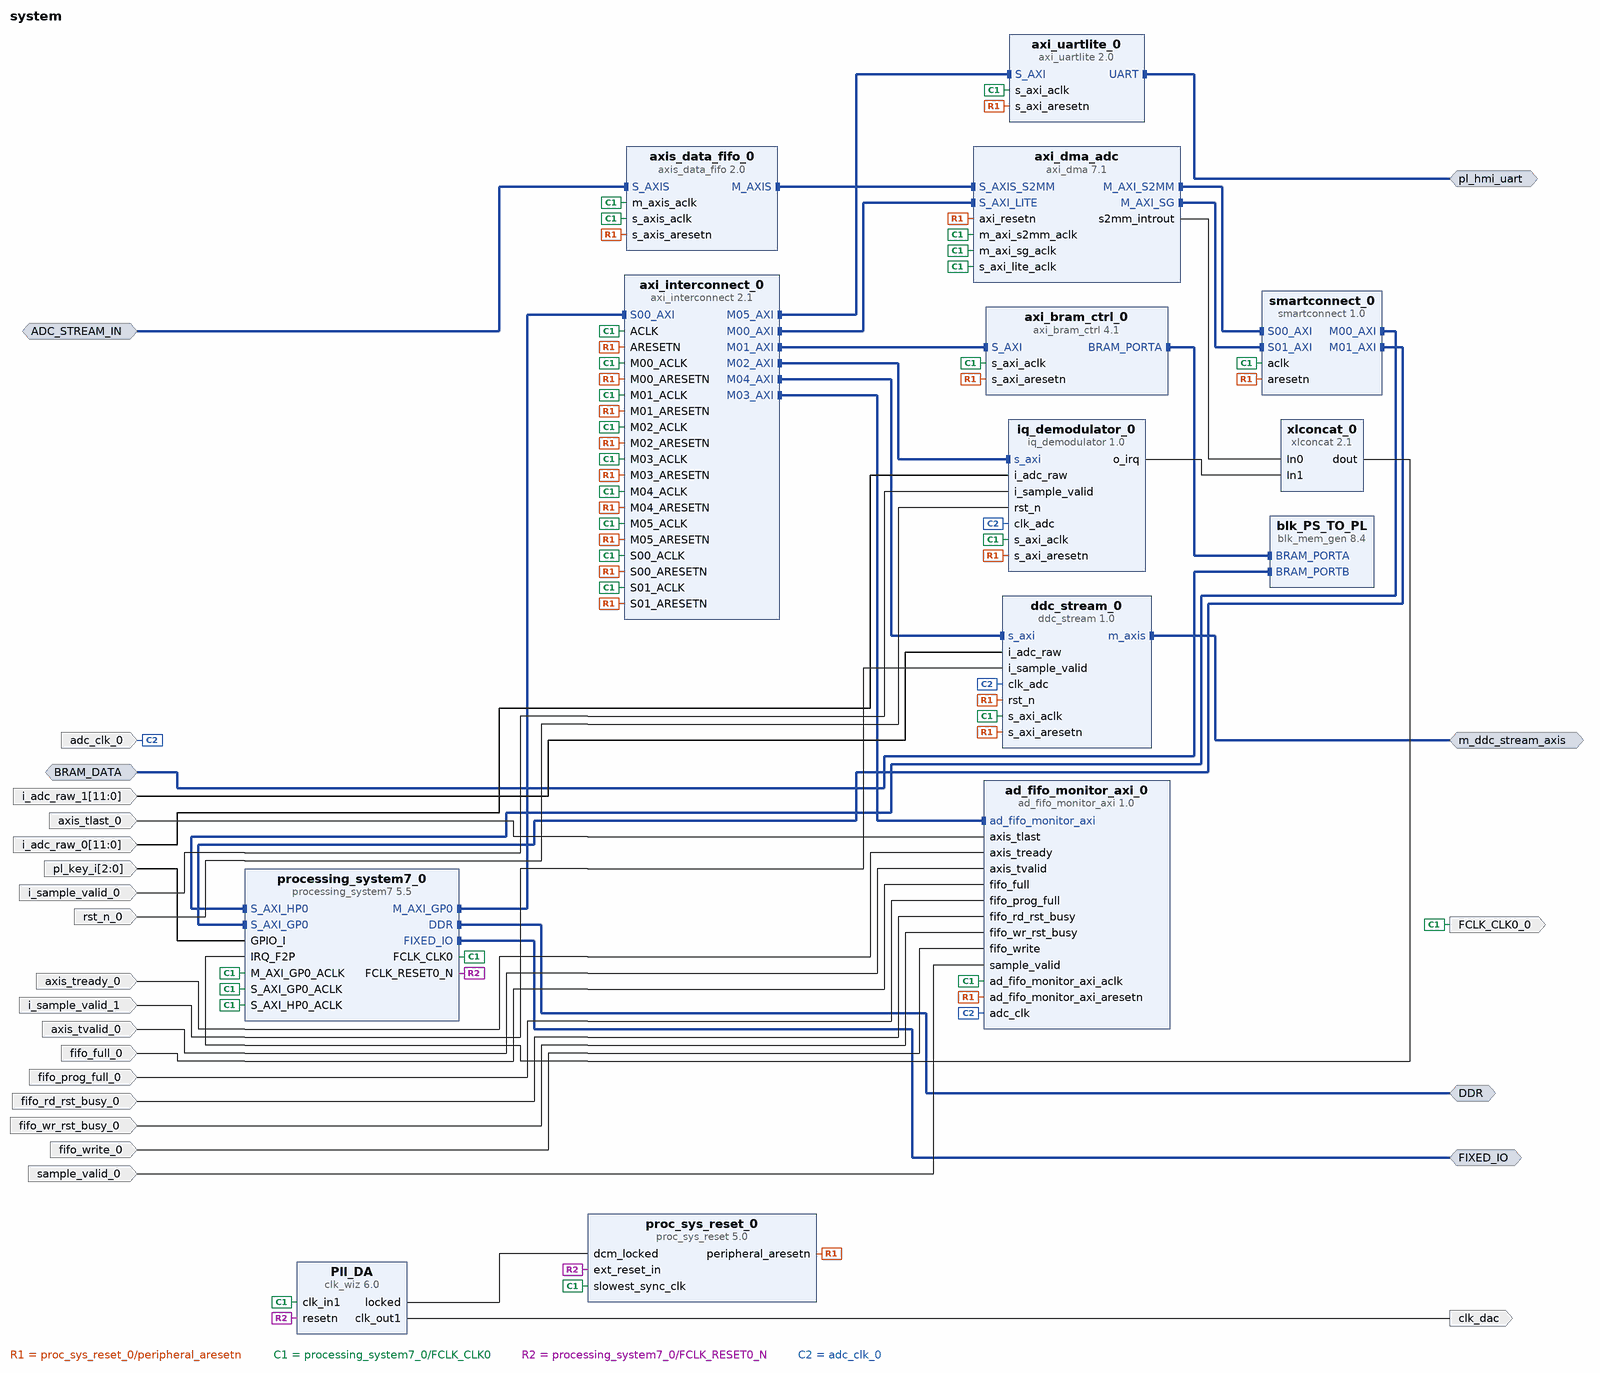
[diagram p0: block diagram of the top level]
# Vivado block design system, xc7z020clg400-2, Vivado 2020.2
create_bd_design system

create_bd_intf_port -mode Slave -vlnv xilinx.com:interface:axis_rtl:1.0 ADC_STREAM_IN
set_property -dict [list \
  CONFIG.HAS_TKEEP 0 \
  CONFIG.HAS_TLAST 1 \
  CONFIG.HAS_TREADY 1 \
  CONFIG.HAS_TSTRB 0 \
  CONFIG.LAYERED_METADATA undef \
  CONFIG.TDATA_NUM_BYTES 2 \
  CONFIG.TDEST_WIDTH 0 \
  CONFIG.TID_WIDTH 0 \
  CONFIG.TUSER_WIDTH 0 \
] [get_bd_intf_ports ADC_STREAM_IN]
create_bd_intf_port -mode Slave -vlnv xilinx.com:interface:bram_rtl:1.0 BRAM_DATA
set_property -dict {CONFIG.MASTER_TYPE BRAM_CTRL} [get_bd_intf_ports BRAM_DATA]
create_bd_intf_port -mode Master -vlnv xilinx.com:interface:ddrx_rtl:1.0 DDR
create_bd_intf_port -mode Master -vlnv xilinx.com:display_processing_system7:fixedio_rtl:1.0 FIXED_IO
create_bd_intf_port -mode Master -vlnv xilinx.com:interface:axis_rtl:1.0 m_ddc_stream_axis
create_bd_intf_port -mode Master -vlnv xilinx.com:interface:uart_rtl:1.0 pl_hmi_uart
create_bd_port -dir O -type clk FCLK_CLK0_0
set_property -dict {CONFIG.ASSOCIATED_BUSIF ADC_STREAM_IN:m_ddc_stream_axis} [get_bd_ports FCLK_CLK0_0]
create_bd_port -dir I axis_tlast_0
create_bd_port -dir I axis_tready_0
create_bd_port -dir I axis_tvalid_0
create_bd_port -dir O -type clk clk_dac
set_property -dict {CONFIG.FREQ_HZ 125000000} [get_bd_ports clk_dac]
create_bd_port -dir I fifo_full_0
create_bd_port -dir I fifo_prog_full_0
create_bd_port -dir I fifo_rd_rst_busy_0
create_bd_port -dir I fifo_wr_rst_busy_0
create_bd_port -dir I fifo_write_0
create_bd_port -dir I -from 11 -to 0 i_adc_raw_0
create_bd_port -dir I i_sample_valid_0
create_bd_port -dir I -from 2 -to 0 pl_key_i
create_bd_port -dir I -type rst rst_n_0
create_bd_port -dir I sample_valid_0
create_bd_port -dir I -type clk adc_clk_0
set_property -dict {CONFIG.FREQ_HZ 5120060} [get_bd_ports adc_clk_0]
create_bd_port -dir I -from 11 -to 0 i_adc_raw_1
create_bd_port -dir I i_sample_valid_1

create_bd_cell -type ip -vlnv xilinx.com:ip:clk_wiz:6.0 Pll_DA
set_property -dict [list \
  CONFIG.CLKOUT1_JITTER 125.247 \
  CONFIG.CLKOUT1_REQUESTED_OUT_FREQ 125 \
  CONFIG.MMCM_CLKOUT0_DIVIDE_F 8.000 \
  CONFIG.RESET_PORT resetn \
  CONFIG.RESET_TYPE ACTIVE_LOW \
] [get_bd_cells Pll_DA]
create_bd_cell -type ip -vlnv xilinx.com:ip:axi_bram_ctrl:4.1 axi_bram_ctrl_0
set_property -dict {CONFIG.PROTOCOL AXI4LITE CONFIG.SINGLE_PORT_BRAM 1} [get_bd_cells axi_bram_ctrl_0]
create_bd_cell -type ip -vlnv xilinx.com:ip:axi_dma:7.1 axi_dma_adc
set_property -dict [list \
  CONFIG.c_include_mm2s 0 \
  CONFIG.c_include_sg 1 \
  CONFIG.c_m_axi_s2mm_data_width 64 \
  CONFIG.c_s_axis_s2mm_tdata_width 16 \
  CONFIG.c_sg_include_stscntrl_strm 0 \
  CONFIG.c_sg_length_width 23 \
] [get_bd_cells axi_dma_adc]
create_bd_cell -type ip -vlnv xilinx.com:ip:axi_interconnect:2.1 axi_interconnect_0
set_property -dict {CONFIG.NUM_MI 6 CONFIG.NUM_SI 2} [get_bd_cells axi_interconnect_0]
create_bd_cell -type ip -vlnv xilinx.com:ip:axis_data_fifo:2.0 axis_data_fifo_0
set_property -dict [list \
  CONFIG.FIFO_DEPTH 4096 \
  CONFIG.HAS_TLAST 1 \
  CONFIG.IS_ACLK_ASYNC 1 \
  CONFIG.TDATA_NUM_BYTES 2 \
] [get_bd_cells axis_data_fifo_0]
create_bd_cell -type ip -vlnv xilinx.com:ip:blk_mem_gen:8.4 blk_PS_TO_PL
set_property -dict [list \
  CONFIG.Enable_B Use_ENB_Pin \
  CONFIG.Memory_Type True_Dual_Port_RAM \
  CONFIG.Port_B_Clock 125 \
  CONFIG.Port_B_Enable_Rate 100 \
  CONFIG.Port_B_Write_Rate 50 \
  CONFIG.Use_RSTB_Pin true \
] [get_bd_cells blk_PS_TO_PL]
create_bd_cell -type ip -vlnv xilinx.com:user:iq_demodulator:1.0 iq_demodulator_0
create_bd_cell -type ip -vlnv xilinx.com:ip:proc_sys_reset:5.0 proc_sys_reset_0
create_bd_cell -type ip -vlnv xilinx.com:ip:processing_system7:5.5 processing_system7_0
set_property -dict [list \
  CONFIG.PCW_FPGA0_PERIPHERAL_FREQMHZ 100 \
  CONFIG.PCW_GPIO_EMIO_GPIO_ENABLE 1 \
  CONFIG.PCW_GPIO_EMIO_GPIO_IO 3 \
  CONFIG.PCW_GPIO_EMIO_GPIO_WIDTH 3 \
  CONFIG.PCW_GPIO_MIO_GPIO_ENABLE 1 \
  CONFIG.PCW_GPIO_MIO_GPIO_IO MIO \
  CONFIG.PCW_I2C_RESET_ENABLE 1 \
  CONFIG.PCW_IRQ_F2P_INTR 1 \
  CONFIG.PCW_PRESET_BANK1_VOLTAGE {LVCMOS 1.8V} \
  CONFIG.PCW_SD0_GRP_CD_ENABLE 1 \
  CONFIG.PCW_SD0_GRP_CD_IO {MIO 47} \
  CONFIG.PCW_SD0_GRP_WP_ENABLE 0 \
  CONFIG.PCW_SD0_PERIPHERAL_ENABLE 1 \
  CONFIG.PCW_SD0_SD0_IO {MIO 40 .. 45} \
  CONFIG.PCW_SDIO_PERIPHERAL_FREQMHZ 100 \
  CONFIG.PCW_UART1_PERIPHERAL_ENABLE 1 \
  CONFIG.PCW_UART1_UART1_IO {MIO 48 .. 49} \
  CONFIG.PCW_UART_PERIPHERAL_FREQMHZ 100 \
  CONFIG.PCW_UIPARAM_DDR_PARTNO {MT41J256M16 RE-125} \
  CONFIG.PCW_USB_RESET_ENABLE 1 \
  CONFIG.PCW_USE_FABRIC_INTERRUPT 1 \
  CONFIG.PCW_USE_S_AXI_GP0 1 \
  CONFIG.PCW_USE_S_AXI_HP0 1 \
] [get_bd_cells processing_system7_0]
# 196 more settings of processing_system7_0 are not shown: defaults, MIO pin electricals, DDR timing, and values the tool derives
create_bd_cell -type ip -vlnv xilinx.com:ip:smartconnect:1.0 smartconnect_0
set_property -dict {CONFIG.NUM_MI 2} [get_bd_cells smartconnect_0]
create_bd_cell -type ip -vlnv xilinx.com:user:ad_fifo_monitor_axi:1.0 ad_fifo_monitor_axi_0
create_bd_cell -type ip -vlnv xilinx.com:user:ddc_stream:1.0 ddc_stream_0
create_bd_cell -type ip -vlnv xilinx.com:ip:xlconcat:2.1 xlconcat_0
create_bd_cell -type ip -vlnv xilinx.com:ip:axi_uartlite:2.0 axi_uartlite_0
set_property -dict {CONFIG.C_BAUDRATE 230400} [get_bd_cells axi_uartlite_0]

# ---- connections ----

connect_bd_intf_net [get_bd_intf_pins axi_bram_ctrl_0/BRAM_PORTA] [get_bd_intf_pins blk_PS_TO_PL/BRAM_PORTA]
connect_bd_intf_net [get_bd_intf_pins axi_dma_adc/S_AXIS_S2MM] [get_bd_intf_pins axis_data_fifo_0/M_AXIS]
connect_bd_intf_net [get_bd_intf_ports DDR] [get_bd_intf_pins processing_system7_0/DDR]
connect_bd_intf_net [get_bd_intf_pins axi_bram_ctrl_0/S_AXI] [get_bd_intf_pins axi_interconnect_0/M01_AXI]
connect_bd_intf_net [get_bd_intf_pins processing_system7_0/S_AXI_HP0] [get_bd_intf_pins smartconnect_0/M00_AXI]
connect_bd_intf_net [get_bd_intf_pins axi_interconnect_0/S00_AXI] [get_bd_intf_pins processing_system7_0/M_AXI_GP0]
connect_bd_intf_net [get_bd_intf_pins axi_dma_adc/S_AXI_LITE] [get_bd_intf_pins axi_interconnect_0/M00_AXI]
connect_bd_intf_net -intf_net axi_dma_0_M_AXI_S2MM [get_bd_intf_pins axi_dma_adc/M_AXI_S2MM] [get_bd_intf_pins smartconnect_0/S00_AXI]
connect_bd_intf_net [get_bd_intf_pins axi_interconnect_0/M02_AXI] [get_bd_intf_pins iq_demodulator_0/s_axi]
connect_bd_intf_net [get_bd_intf_pins axi_interconnect_0/M04_AXI] [get_bd_intf_pins ddc_stream_0/s_axi]
connect_bd_intf_net [get_bd_intf_ports FIXED_IO] [get_bd_intf_pins processing_system7_0/FIXED_IO]
connect_bd_intf_net [get_bd_intf_pins processing_system7_0/S_AXI_GP0] [get_bd_intf_pins smartconnect_0/M01_AXI]
connect_bd_intf_net [get_bd_intf_pins ad_fifo_monitor_axi_0/ad_fifo_monitor_axi] [get_bd_intf_pins axi_interconnect_0/M03_AXI]
connect_bd_intf_net -intf_net BRAM_PORTB_0_1 [get_bd_intf_ports BRAM_DATA] [get_bd_intf_pins blk_PS_TO_PL/BRAM_PORTB]
connect_bd_intf_net -intf_net S_AXIS_0_1 [get_bd_intf_ports ADC_STREAM_IN] [get_bd_intf_pins axis_data_fifo_0/S_AXIS]
connect_bd_intf_net [get_bd_intf_ports m_ddc_stream_axis] [get_bd_intf_pins ddc_stream_0/m_axis]
connect_bd_intf_net [get_bd_intf_pins axi_dma_adc/M_AXI_SG] [get_bd_intf_pins smartconnect_0/S01_AXI]
connect_bd_intf_net [get_bd_intf_pins axi_interconnect_0/M05_AXI] [get_bd_intf_pins axi_uartlite_0/S_AXI]
connect_bd_intf_net [get_bd_intf_ports pl_hmi_uart] [get_bd_intf_pins axi_uartlite_0/UART]
connect_bd_net -net GPIO_I_0_1 [get_bd_ports pl_key_i] [get_bd_pins processing_system7_0/GPIO_I]
connect_bd_net [get_bd_pins Pll_DA/locked] [get_bd_pins proc_sys_reset_0/dcm_locked]
connect_bd_net -net axis_tlast_0_1 [get_bd_ports axis_tlast_0] [get_bd_pins ad_fifo_monitor_axi_0/axis_tlast]
connect_bd_net -net axis_tready_0_1 [get_bd_ports axis_tready_0] [get_bd_pins ad_fifo_monitor_axi_0/axis_tready]
connect_bd_net -net axis_tvalid_0_1 [get_bd_ports axis_tvalid_0] [get_bd_pins ad_fifo_monitor_axi_0/axis_tvalid]
connect_bd_net -net clk_wiz_0_clk_out1 [get_bd_pins Pll_DA/clk_out1] [get_bd_ports clk_dac]
connect_bd_net -net fifo_full_0_1 [get_bd_ports fifo_full_0] [get_bd_pins ad_fifo_monitor_axi_0/fifo_full]
connect_bd_net -net fifo_prog_full_0_1 [get_bd_ports fifo_prog_full_0] [get_bd_pins ad_fifo_monitor_axi_0/fifo_prog_full]
connect_bd_net -net fifo_rd_rst_busy_0_1 [get_bd_ports fifo_rd_rst_busy_0] [get_bd_pins ad_fifo_monitor_axi_0/fifo_rd_rst_busy]
connect_bd_net -net fifo_wr_rst_busy_0_1 [get_bd_ports fifo_wr_rst_busy_0] [get_bd_pins ad_fifo_monitor_axi_0/fifo_wr_rst_busy]
connect_bd_net -net fifo_write_0_1 [get_bd_ports fifo_write_0] [get_bd_pins ad_fifo_monitor_axi_0/fifo_write]
connect_bd_net -net i_adc_raw_0_1 [get_bd_ports i_adc_raw_0] [get_bd_pins iq_demodulator_0/i_adc_raw]
connect_bd_net -net i_sample_valid_0_1 [get_bd_ports i_sample_valid_0] [get_bd_pins iq_demodulator_0/i_sample_valid]
connect_bd_net [get_bd_pins proc_sys_reset_0/peripheral_aresetn] \
  [get_bd_pins axi_bram_ctrl_0/s_axi_aresetn] [get_bd_pins axi_dma_adc/axi_resetn] [get_bd_pins axi_interconnect_0/ARESETN] \
  [get_bd_pins axi_interconnect_0/M00_ARESETN] [get_bd_pins axi_interconnect_0/M01_ARESETN] \
  [get_bd_pins axi_interconnect_0/M02_ARESETN] [get_bd_pins axi_interconnect_0/M03_ARESETN] \
  [get_bd_pins axi_interconnect_0/S00_ARESETN] [get_bd_pins axi_interconnect_0/S01_ARESETN] \
  [get_bd_pins axis_data_fifo_0/s_axis_aresetn] [get_bd_pins iq_demodulator_0/s_axi_aresetn] \
  [get_bd_pins smartconnect_0/aresetn] [get_bd_pins ad_fifo_monitor_axi_0/ad_fifo_monitor_axi_aresetn] \
  [get_bd_pins axi_interconnect_0/M04_ARESETN] [get_bd_pins ddc_stream_0/rst_n] [get_bd_pins ddc_stream_0/s_axi_aresetn] \
  [get_bd_pins axi_uartlite_0/s_axi_aresetn] [get_bd_pins axi_interconnect_0/M05_ARESETN]
connect_bd_net [get_bd_pins processing_system7_0/FCLK_CLK0] \
  [get_bd_ports FCLK_CLK0_0] [get_bd_pins Pll_DA/clk_in1] [get_bd_pins axi_bram_ctrl_0/s_axi_aclk] \
  [get_bd_pins axi_dma_adc/m_axi_s2mm_aclk] [get_bd_pins axi_dma_adc/s_axi_lite_aclk] [get_bd_pins axi_interconnect_0/ACLK] \
  [get_bd_pins axi_interconnect_0/M00_ACLK] [get_bd_pins axi_interconnect_0/M01_ACLK] \
  [get_bd_pins axi_interconnect_0/M02_ACLK] [get_bd_pins axi_interconnect_0/M03_ACLK] \
  [get_bd_pins axi_interconnect_0/S00_ACLK] [get_bd_pins axi_interconnect_0/S01_ACLK] \
  [get_bd_pins axis_data_fifo_0/m_axis_aclk] [get_bd_pins axis_data_fifo_0/s_axis_aclk] \
  [get_bd_pins iq_demodulator_0/s_axi_aclk] [get_bd_pins proc_sys_reset_0/slowest_sync_clk] \
  [get_bd_pins processing_system7_0/M_AXI_GP0_ACLK] [get_bd_pins processing_system7_0/S_AXI_GP0_ACLK] \
  [get_bd_pins processing_system7_0/S_AXI_HP0_ACLK] [get_bd_pins smartconnect_0/aclk] \
  [get_bd_pins ad_fifo_monitor_axi_0/ad_fifo_monitor_axi_aclk] [get_bd_pins axi_interconnect_0/M04_ACLK] \
  [get_bd_pins ddc_stream_0/s_axi_aclk] [get_bd_pins axi_dma_adc/m_axi_sg_aclk] [get_bd_pins axi_uartlite_0/s_axi_aclk] \
  [get_bd_pins axi_interconnect_0/M05_ACLK]
connect_bd_net [get_bd_pins processing_system7_0/FCLK_RESET0_N] [get_bd_pins Pll_DA/resetn] [get_bd_pins proc_sys_reset_0/ext_reset_in]
connect_bd_net -net rst_n_0_1 [get_bd_ports rst_n_0] [get_bd_pins iq_demodulator_0/rst_n]
connect_bd_net -net sample_valid_0_1 [get_bd_ports sample_valid_0] [get_bd_pins ad_fifo_monitor_axi_0/sample_valid]
connect_bd_net -net adc_clk_0_1 [get_bd_ports adc_clk_0] \
  [get_bd_pins iq_demodulator_0/clk_adc] [get_bd_pins ad_fifo_monitor_axi_0/adc_clk] [get_bd_pins ddc_stream_0/clk_adc]
connect_bd_net -net i_adc_raw_1_1 [get_bd_ports i_adc_raw_1] [get_bd_pins ddc_stream_0/i_adc_raw]
connect_bd_net -net i_sample_valid_1_1 [get_bd_ports i_sample_valid_1] [get_bd_pins ddc_stream_0/i_sample_valid]
connect_bd_net [get_bd_pins iq_demodulator_0/o_irq] [get_bd_pins xlconcat_0/In1]
connect_bd_net [get_bd_pins axi_dma_adc/s2mm_introut] [get_bd_pins xlconcat_0/In0]
connect_bd_net [get_bd_pins xlconcat_0/dout] [get_bd_pins processing_system7_0/IRQ_F2P]
set_property HDL_ATTRIBUTE.BMM_INFO_ADDRESS_SPACE {byte  0x40000000 32 > system blk_PS_TO_PL} [get_bd_cells axi_bram_ctrl_0]
set_property HDL_ATTRIBUTE.KEEP_HIERARCHY yes [get_bd_cells axi_bram_ctrl_0]
set_property HDL_ATTRIBUTE.BMM_INFO_PROCESSOR {arm > system axi_bram_ctrl_0} [get_bd_cells processing_system7_0]
set_property HDL_ATTRIBUTE.KEEP_HIERARCHY yes [get_bd_cells processing_system7_0]

# ---- address map ----
assign_bd_address -offset 0x00000000 -range 1G -target_address_space [get_bd_addr_spaces axi_dma_adc/Data_S2MM] [get_bd_addr_segs processing_system7_0/S_AXI_HP0/HP0_DDR_LOWOCM]
exclude_bd_addr_seg -offset 0x00000000 -range 1G -target_address_space [get_bd_addr_spaces axi_dma_adc/Data_S2MM] [get_bd_addr_segs processing_system7_0/S_AXI_GP0/GP0_DDR_LOWOCM]
exclude_bd_addr_seg -offset 0x40000000 -range 1G -target_address_space [get_bd_addr_spaces axi_dma_adc/Data_S2MM] [get_bd_addr_segs processing_system7_0/S_AXI_GP0/GP0_M_AXI_GP0]
exclude_bd_addr_seg -offset 0xE0000000 -range 4M -target_address_space [get_bd_addr_spaces axi_dma_adc/Data_S2MM] [get_bd_addr_segs processing_system7_0/S_AXI_GP0/GP0_IOP]
assign_bd_address -offset 0x00000000 -range 1G -target_address_space [get_bd_addr_spaces axi_dma_adc/Data_SG] [get_bd_addr_segs processing_system7_0/S_AXI_HP0/HP0_DDR_LOWOCM]
exclude_bd_addr_seg -offset 0x00000000 -range 1G -target_address_space [get_bd_addr_spaces axi_dma_adc/Data_SG] [get_bd_addr_segs processing_system7_0/S_AXI_GP0/GP0_DDR_LOWOCM]
exclude_bd_addr_seg -offset 0x40000000 -range 1G -target_address_space [get_bd_addr_spaces axi_dma_adc/Data_SG] [get_bd_addr_segs processing_system7_0/S_AXI_GP0/GP0_M_AXI_GP0]
exclude_bd_addr_seg -offset 0xE0000000 -range 4M -target_address_space [get_bd_addr_spaces axi_dma_adc/Data_SG] [get_bd_addr_segs processing_system7_0/S_AXI_GP0/GP0_IOP]
assign_bd_address -offset 0x40000000 -range 8K -target_address_space [get_bd_addr_spaces processing_system7_0/Data] [get_bd_addr_segs axi_bram_ctrl_0/S_AXI/Mem0]
assign_bd_address -offset 0x40400000 -range 64K -target_address_space [get_bd_addr_spaces processing_system7_0/Data] [get_bd_addr_segs axi_dma_adc/S_AXI_LITE/Reg]
assign_bd_address -offset 0x43C00000 -range 64K -target_address_space [get_bd_addr_spaces processing_system7_0/Data] [get_bd_addr_segs iq_demodulator_0/s_axi/reg0]
assign_bd_address -offset 0x43C10000 -range 64K -target_address_space [get_bd_addr_spaces processing_system7_0/Data] [get_bd_addr_segs ad_fifo_monitor_axi_0/ad_fifo_monitor_axi/ad_fifo_monitor_axi_reg]
assign_bd_address -offset 0x43C20000 -range 4K -target_address_space [get_bd_addr_spaces processing_system7_0/Data] [get_bd_addr_segs ddc_stream_0/s_axi/reg0]
assign_bd_address -offset 0x43C30000 -range 64K -target_address_space [get_bd_addr_spaces processing_system7_0/Data] [get_bd_addr_segs axi_uartlite_0/S_AXI/Reg]

validate_bd_design
save_bd_design
